# Altium schematic sheet Amplificador Clase D.SchDoc
size A3; DocumentNumber: 5; SheetNumber: 5; SheetTotal: 5
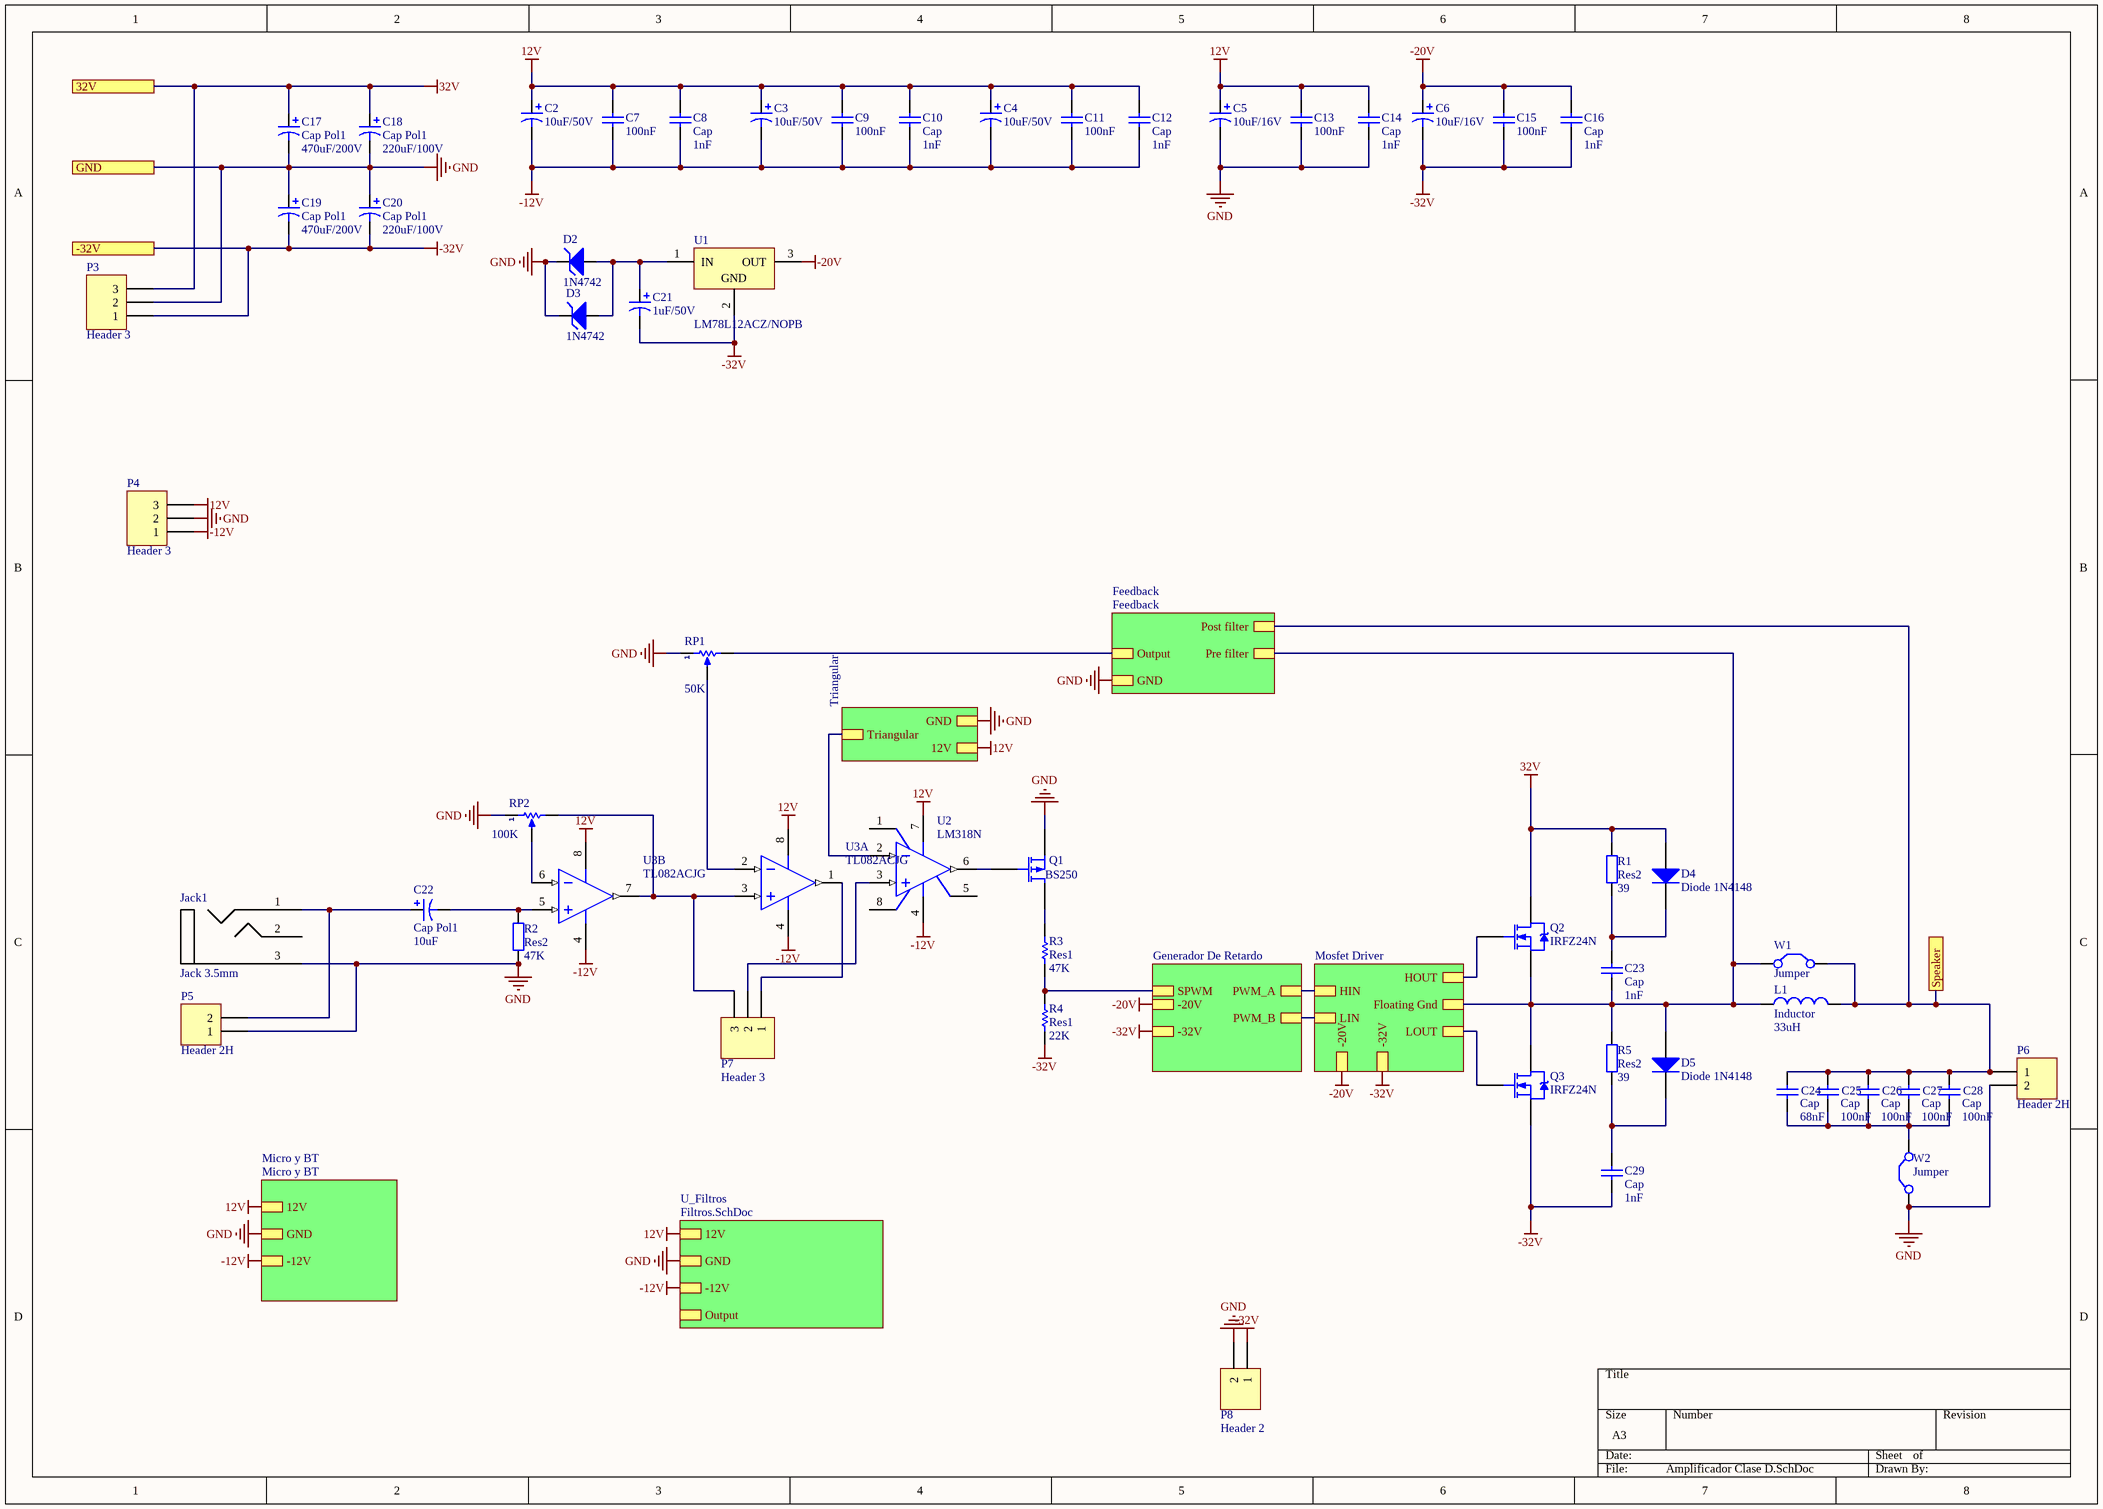
[diagram p0: Amplificador Clase D.SchDoc]

## Parts
C2  VALOR: 10uF/50V  [CAPR D250 H450 R100 mil]  (hidden comment: Cap Electrolitico Radial)
C3  VALOR: 10uF/50V  [CAPR D250 H450 R100 mil]  (hidden comment: Cap Electrolitico Radial)
C4  VALOR: 10uF/50V  [CAPR D250 H450 R100 mil]  (hidden comment: Cap Electrolitico Radial)
C5  VALOR: 10uF/16V  [CAPR D250 H450 R100 mil]  (hidden comment: Cap Electrolitico Radial)
C6  VALOR: 10uF/16V  [CAPR D250 H450 R100 mil]  (hidden comment: Cap Electrolitico Radial)
C7  VALOR: 100nF  [RAD-0.3]  (hidden comment: Cap Ceramico Disco)
C8  Cap  value 1nF  [CAP DISCO 200mil]
C9  VALOR: 100nF  [RAD-0.3]  (hidden comment: Cap Ceramico Disco)
C10  Cap  value 1nF  [CAP DISCO 200mil]
C11  VALOR: 100nF  [RAD-0.3]  (hidden comment: Cap Ceramico Disco)
C12  Cap  value 1nF  [CAP DISCO 200mil]
C13  VALOR: 100nF  [RAD-0.3]  (hidden comment: Cap Ceramico Disco)
C14  Cap  value 1nF  [CAP DISCO 200mil]
C15  VALOR: 100nF  [RAD-0.3]  (hidden comment: Cap Ceramico Disco)
C16  Cap  value 1nF  [CAP DISCO 200mil]
C17  Cap Pol1  value 470uF/200V  [CAPR D700 H1400 R300 mil]
C18  Cap Pol1  value 220uF/100V  [CAPR D500 H1000 R200 mil]
C19  Cap Pol1  value 470uF/200V  [CAPR D700 H1400 R300 mil]
C20  Cap Pol1  value 220uF/100V  [CAPR D500 H1000 R200 mil]
C21  VALOR: 1uF/50V  [CAPR D250 H450 R100 mil]  (hidden comment: Cap Electrolitico Radial)
C22  Cap Pol1  value 10uF  [CAPR D250 H450 R100 mil]
C23  Cap  value 1nF  [CAP DISCO 200mil]
C24  Cap  value 68nF  [RAD-0.4]
C25  Cap  value 100nF  [RAD-0.4]
C26  Cap  value 100nF  [RAD-0.4]
C27  Cap  value 100nF  [RAD-0.4]
C28  Cap  value 100nF  [RAD-0.4]
C29  Cap  value 1nF  [CAP DISCO 200mil]
D2  VALOR: 1N4742  [DO-41]  (hidden comment: Diodo Zener)
D3  VALOR: 1N4742  [DO-41]  (hidden comment: Diodo Zener)
D4  Diode 1N4148  [DO-41]
D5  Diode 1N4148  [DO-41]
Jack1  Jack 3.5mm  [jack 3.5mm]
L1  Inductor  value 33uH  [Bobina 1.5*3]
P3  Header 3  [bornera 3]
P4  Header 3  [bornera 3]
P5  Header 2H  [bornera 2]
P6  Header 2H  [bornera 2]
P7  Header 3  [HDR1X3]
P8  Header 2  [HDR1X2]
Q1  BS250  [TO-92W]
Q2  IRFZ24N  [TO-220AB]
Q3  IRFZ24N  [TO-220AB]
R1  Res2  value 39  [AXIAL-0.4]
R2  Res2  value 47K  [1206 resistor]
R3  Res1  value 47K  [1206 resistor]
R4  Res1  value 22K  [1206 resistor]
R5  Res2  value 39  [AXIAL-0.4]
RP1  VALOR: 50K  [Trimpot Multivuelta Vertical]  (hidden comment: Trimpot)
RP2  VALOR: 100K  [Trimpot Multivuelta Vertical]  (hidden comment: Trimpot)
U1  LM78L12ACZ/NOPB  [to-220]
U2  LM318N  [DIP-8]
U3  TL082ACJG  [693-02]  (parts A,B of 2)
W1  Jumper  [RAD-0.2]
W2  Jumper  [RAD-0.2]

## Sub-sheets
Feedback = Feedback: Output, Pre filter, Post filter, GND
Generador De Retardo = Generador De Retardo: SPWM, PWM_A, PWM_B, -20V, -32V
Micro y BT = Micro y BT: 12V, GND, -12V
Mosfet Driver = Mosfet Driver: HIN, LIN, HOUT, LOUT, Floating Gnd, -20V, -32V
Triangular = Triangular: Triangular, 12V, GND
U_Filtros = Filtros.SchDoc: 12V, Output, GND, -12V

## Ports
32V, -32V, GND, Speaker

## Nets
12V: C2.1 C3.1 C4.1 C5.1 C7.2 C8.2 C9.2 C10.2 C11.2 C12.2 C13.2 C14.2 P4.3 U2.7(V+) U3.8(V+) ; sheet Triangular/12V, sheet U_Filtros/12V, sheet Micro y BT/12V
32V: C17.1 C18.1 D4.1(A) P3.3 Q2.2(D) R1.2 ; port 32V
-12V: C2.2 C3.2 C4.2 C7.1 C8.1 C9.1 C10.1 C11.1 C12.1 P4.1 U2.4(V-) U3.4(V-) ; sheet U_Filtros/-12V, sheet Micro y BT/-12V
-20V: C6.1 C15.2 C16.2 U1.3(OUT) ; sheet Generador De Retardo/-20V, sheet Mosfet Driver/-20V
-32V: C6.2 C15.1 C16.1 C19.2 C20.2 C21.2 C29.1 P3.1 P8.1 Q3.3(S) R4.1 U1.2(GND) ; port -32V, sheet Generador De Retardo/-32V, sheet Mosfet Driver/-32V
GND: C5.2 C13.1 C14.1 C17.2 C18.2 C19.1 C20.1 D2.2(K) D3.2(K) Jack1.3(Gnd) P3.2 P4.2 P5.1 P6.2 P8.2 Q1.3(S) R2.1 RP1.1(TOP) RP2.1(TOP) W2.1(C1) ; port GND, sheet Triangular/GND, sheet Feedback/GND, sheet U_Filtros/GND, sheet Micro y BT/GND
Speaker: C24.2 C25.2 C26.2 C27.2 C28.2 L1.2 P6.1 W1.2(C2) ; port Speaker, sheet Feedback/Post filter
NetC21_1: C21.1 D2.1(A) D3.1(A) U1.1(IN)
NetC22_1: C22.1 Jack1.1(R) P5.2
NetC22_2: C22.2 R2.2 U3.5(IN+)
NetC23_1: C23.1 D5.1(A) L1.1 Q2.3(S) Q3.2(D) R5.2 W1.1(C1) ; sheet Mosfet Driver/Floating Gnd, sheet Feedback/Pre filter
NetC23_2: C23.2 D4.2(K) R1.1
NetC24_1: C24.1 C25.1 C26.1 C27.1 C28.1 W2.2(C2)
NetC29_2: C29.2 D5.2(K) R5.1
NetP7_1: P7.1 U3.1(OUT)
NetP7_2: P7.2 U2.3(IN+)
NetP7_3: P7.3 RP2.2(BOT) U3.3(IN+) U3.7(OUT)
NetQ1_1: Q1.1(D) R3.2
NetQ1_2: Q1.2(G) U2.6(OUT)
NetQ2_1: Q2.1(G) ; sheet Mosfet Driver/HOUT
NetQ3_1: Q3.1(G) ; sheet Mosfet Driver/LOUT
NetR3_1: R3.1 R4.2 ; sheet Generador De Retardo/SPWM
NetRP1_2: RP1.2(BOT) ; sheet Feedback/Output
NetRP1_3: RP1.3(TAP) U3.2(IN-)
NetRP2_3: RP2.3(TAP) U3.6(IN-)
NetU2_2: U2.2(IN-) ; sheet Triangular/Triangular
(unnamed): sheet Generador De Retardo/PWM_A, sheet Mosfet Driver/HIN
(unnamed): sheet Generador De Retardo/PWM_B, sheet Mosfet Driver/LIN

Not connected (* = marked no-connect by the designer): Jack1 2(L); U2 1(BAL/COMP1) 5(BAL/COMP3) 8(COMP2)

## Library data of the parts
C2-C6 C21 = Cap Electrolitico Radial: Cap Electrolitico de insercion; CODIGO STI: *; PROVEEDOR: *; FABRICANTE: *
C7 C9 C11 C13 C15 = Cap Ceramico Disco: Capacitor Ceramico de Insercion; FABRICANTE: Generico; CODIGO STI: *; PROVEEDOR: *
C8 C10 C12 C14 C16 C23-C29 = Cap: Capacitor; Published: 8-Jun-2000; LatestRevisionDate: 17-Jul-2002; LatestRevisionNote: Re-released for DXP Platform.; PackageReference: RAD-0.3; Publisher: Altium Limited; PackageDescription: Radial Cap, Thru-Hole; 2 Leads; 0.3 in Pin Spacing
C17-C20 C22 = Cap Pol1: Polarized Capacitor (Radial); Published: 8-Jun-2000; LatestRevisionDate: 17-Jul-2002; LatestRevisionNote: Re-released for DXP Platform.; PackageReference: RB7.6-15; Publisher: Altium Limited; PackageDescription: Polarized Capacitor (Radial); 2 Leads
D4 D5 = Diode 1N4148: High Conductance Fast Diode; Published: 8-Jun-2000; LatestRevisionDate: 17-Jul-2002; LatestRevisionNote: Re-released for DXP Platform.; DatasheetVersion: 1997; PackageReference: DO-35; Publisher: Altium Limited; PackageDescription: Diode, Axial; Body 3.8 x 1.9 mm (LxDia. max), Lead Dia. 0.53 mm (max); Code_JEDEC: DO-204-AH; ComponentLink1Description: Manufacturer Link; ComponentLink1URL: http://www.fairchildsemi.com/; ComponentLink2Description: Datasheet; ComponentLink2URL: http://www.fairchildsemi.com/ds/1N%2F1N4148.pdf
L1 = Inductor: Code_IEC: 1005; Published: 8-Jun-2000; LatestRevisionDate: 29-May-2009; LatestRevisionNote: IPC-7351 Footprint Added.; PackageReference: 0402-A; Publisher: Altium Limited; PackageDescription: Chip Inductor; Code_JEITA: 0402
P3 P4 P7 = Header 3: Header, 3-Pin; LatestRevisionDate: 17-Jul-2002; LatestRevisionNote: Re-released for DXP Platform.; Publisher: Altium Limited
P5 P6 = Header 2H: Header, 2-Pin, Right Angle; LatestRevisionDate: 17-Jul-2002; LatestRevisionNote: Re-released for DXP Platform.; Publisher: Altium Limited
P8 = Header 2: Header, 2-Pin; LatestRevisionDate: 17-Jul-2002; LatestRevisionNote: Re-released for DXP Platform.; Publisher: Altium Limited
Q1 = MOSFET-P: P-Channel MOSFET; Published: 8-Jun-2000; LatestRevisionDate: 17-Jul-2002; LatestRevisionNote: Re-released for DXP Platform.; PackageVersion: 1995/1996; PackageReference: E3; Publisher: Altium Limited; PackageDescription: TO, Flat Index; 3 In-Line, Axial Leads; Body Dia. 4.6mm; Lead Dia. 0.5 mm (max)
Q2 Q3 = IRFZ24N: HEXFET Power MOSFET; Note: Pin 2 is electrically connected to pin 4.; Published: 8-Jun-2000; LatestRevisionDate: 17-Jul-2002; LatestRevisionNote: Re-released for DXP Platform.; DatasheetVersion: Sep-1999; PackageVersion: Feb-1997; PackageReference: TO-220AB; Publisher: Altium Limited; PackageDescription: TO, Thru-Hole, Vertical, Heatsink Mounted; 3 In-Line Leads; Pitch 2.54 mm; ComponentLink1Description: Manufacturer Link; ComponentLink1URL: http://www.irf.com/; ComponentLink2Description: Datasheet; ComponentLink2URL: http://www.irf.com/product-info/datasheets/data/irfz24n.pdf
R1 R2 R5 = Res2: Resistor; Published: 8-Jun-2000; LatestRevisionDate: 17-Jul-2002; LatestRevisionNote: Re-released for DXP Platform.; PackageReference: AXIAL-0.4; Publisher: Altium Limited; PackageDescription: Axial Device, Thru-Hole; 2 Leads; 0.4 in Pin Spacing
R3 R4 = Res1: Resistor; Published: 8-Jun-2000; LatestRevisionDate: 17-Jul-2002; LatestRevisionNote: Re-released for DXP Platform.; PackageReference: AXIAL-0.3; Publisher: Altium Limited; PackageDescription: Axial Device, Thru-Hole; 2 Leads; 0.3 in Pin Spacing
RP1 RP2 = Trimpot: Preset; CODIGO STI: *; PROVEEDOR: *; FABRICANTE: *
U1 = LM78L12ACZ/NOPB: 3-Terminal Positive Regulators, 3-pin TO-92, Pb-Free; Manufacturer: National Semiconductor; PackageTopMarking: NSXYTT*LM78L*12ACZ; PowerWise: N; CompType: LDO IC; Published: 1-Mar-2010; DatasheetVersion: Apr-2006; PackageVersion: revG, Sep-2000; PackageReference: Z03A; Publisher: Altium Limited; PackageDescription: TO-92, Molded, 3 Lead; Supplier 1: Digi-Key; Supplier Part Number 1: LM78L12ACZ/NOPB-ND; Supplier 2: Farnell; Supplier Part Number 2: 1469110; PartNumber: LM78L12ACZ/NOPB; RoHS: Y; PinCount: 3; Code_JEDEC: TO-226-AA; ComponentLink1Description: LM78L12 Datasheet; ComponentLink1URL: http://www.national.com/ds/LM/LM78L12.pdf; ComponentLink2Description: LM78L12 Web Page; ComponentLink2URL: http://www.national.com/pf/LM/LM78L12.html; ComponentLink3Description: Z03A Package Page; ComponentLink3URL: http://www.national.com/packaging/folders/z03a.html
U2 = LM318N: Operational Amplifier, 8-pin MDIP; Manufacturer: National Semiconductor; PackageTopMarking: NSUZXYTTE#*LM*318N; PowerWise: N; CompType: Amplifiers; Published: 4-Dec-2008; DatasheetVersion: Aug-2000; PackageVersion: revG, May-2006; PackageReference: N08E; Publisher: Altium Limited; PackageDescription: MDIP, .365 x .250 x .130in, 8 Lead, .100in Pitch; Supplier 1: Farnell; Supplier Part Number 1: 398550; PartNumber: LM318N; RoHS: N; PinCount: 8; Code_JEDEC: MS-001-BA; ComponentLink1Description: LM318 Datasheet; ComponentLink1URL: http://www.national.com/ds/LM/LM318.pdf; ComponentLink2Description: LM318 Web Page; ComponentLink2URL: http://www.national.com/pf/LM/LM318.html; ComponentLink3Description: N08E Package Page; ComponentLink3URL: http://www.national.com/packaging/folders/n08e.html
U3 = TL082ACJG: JFET-Input Operational Amplifier; Published: 17-Jul-2002; LatestRevisionDate: 06-Jun-2005; LatestRevisionNote: Stylized 3D Model Added.; DatasheetVersion: 1988; PackageReference: 693-02; Publisher: Altium Limited; PackageDescription: DIP; 8 Leads; Row Spacing 7.62 mm; Pitch 2.54 mm; Code_JEDEC: MO-001-AN; ComponentLink1Description: Manufacturer Link; ComponentLink1URL: http://www.onsemi.com/site/products/parametrics/0,4446,251,00.html
W1 W2 = Jumper: Jumper Wire; Published: 24-Mar-1999; LatestRevisionDate: 17-Jul-2002; LatestRevisionNote: Re-released for DXP Platform.; PackageReference: RAD-0.2; Publisher: Altium Limited; PackageDescription: Radial Cap, Thru-Hole; 2 Leads; 0.2 in Pin Spacing
D2 D3 = Diodo Zener: CODIGO STI: *; PROVEEDOR: *; FABRICANTE: *